# EAGLE design LSM303 breakout board-v12 (EAGLE 6.1)
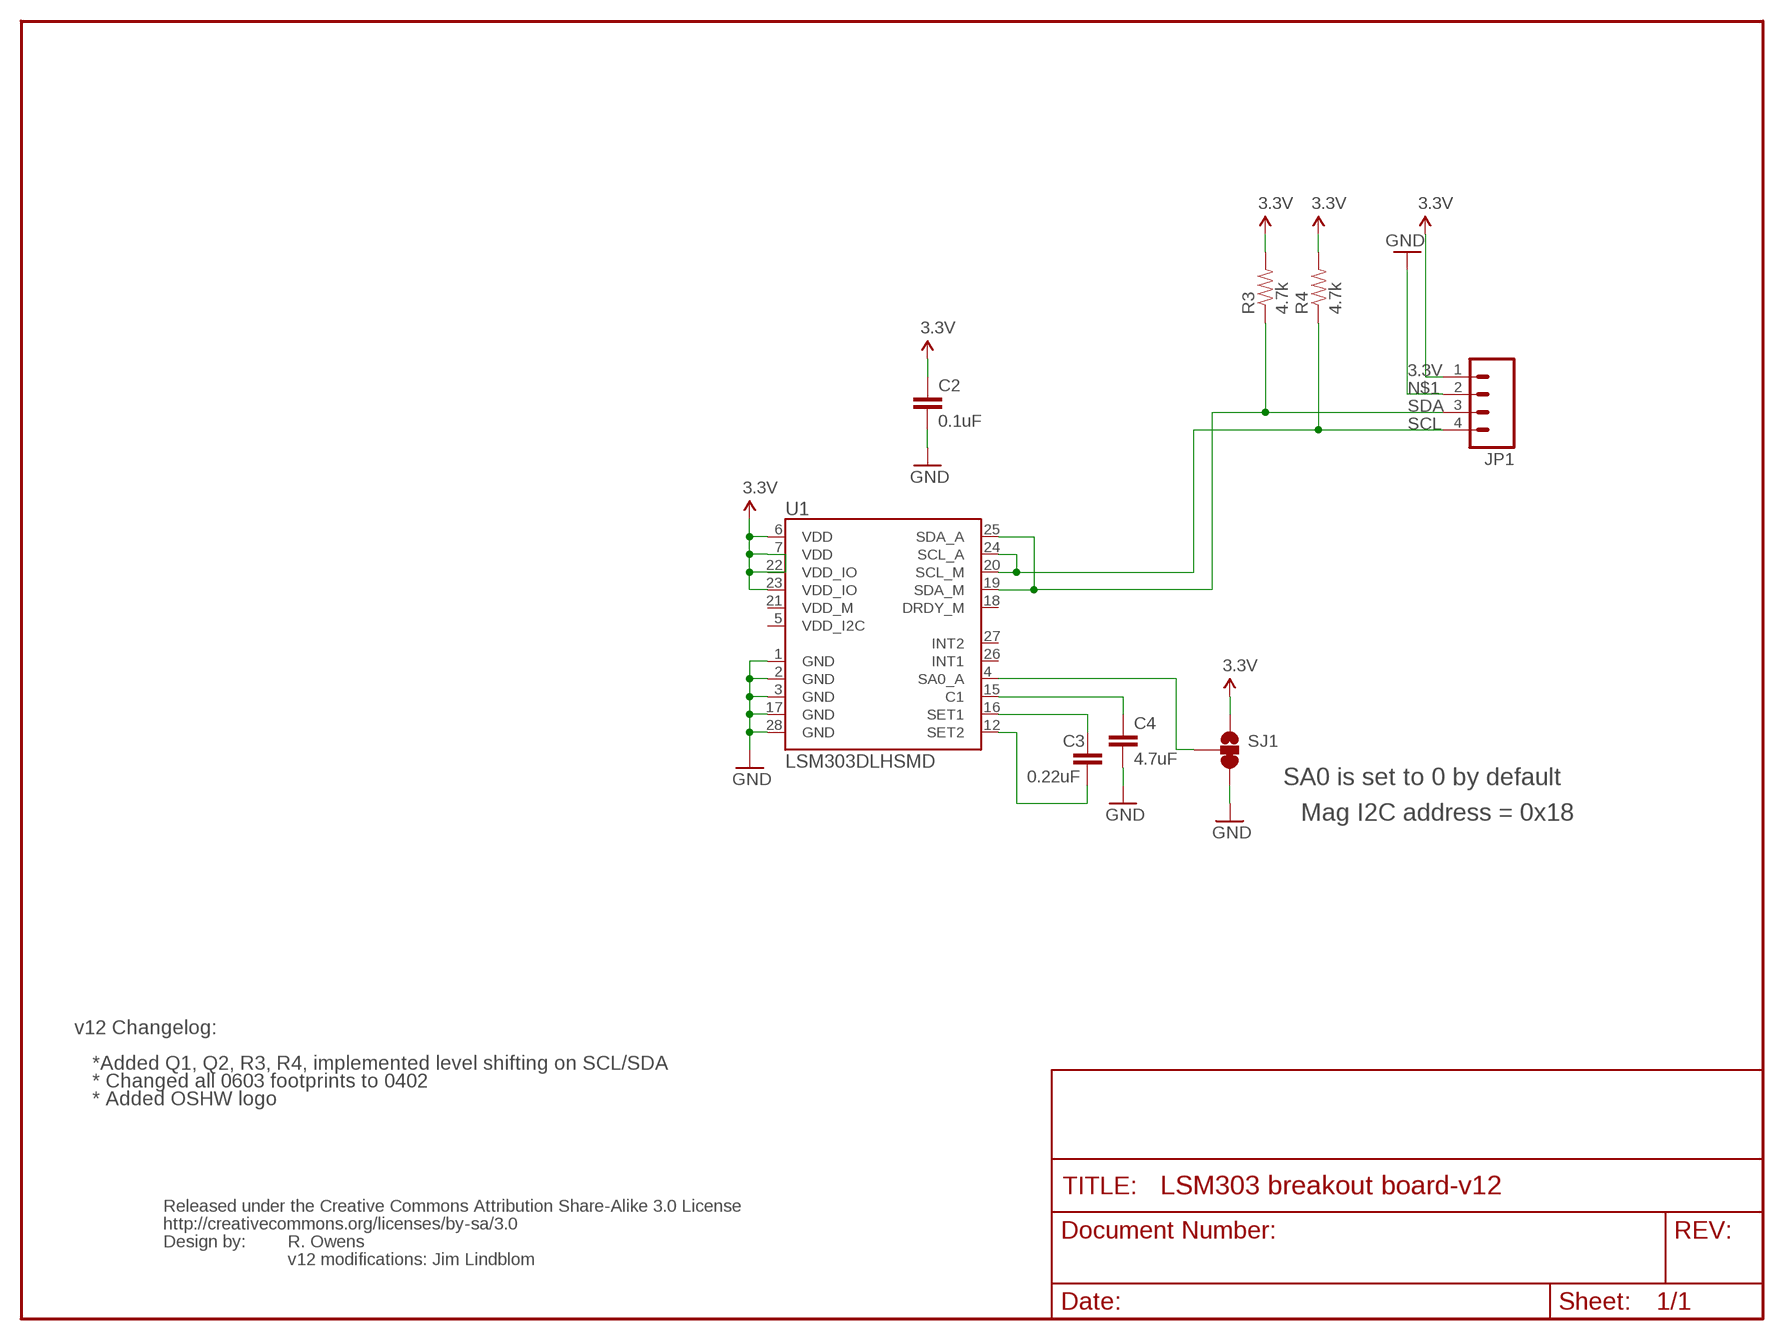
[diagram p0: schematic, sheet 1]

## Parts
C2  0.1uF  CAP0603-CAP  [0603-CAP]
C3  0.22uF  CAP0603-CAP  [0603-CAP]
C4  4.7uF  CAP1206  [1206]
JP1  M04PTH  [1X04]
R3  4.7k  RESISTOR0805-RES  [0805]
R4  4.7k  RESISTOR0805-RES  [0805]
SJ1  SOLDERJUMPER_2WAYPASTE2&3  [SJ_3_PASTE2&3]
U1  LSM303DLHSMD  [LGA28-5X5]
U$5  CREATIVE_COMMONS  [CREATIVE_COMMONS]

## Nets
3.3V: C2.1 JP1.1 R3.2 R4.2 SJ1.1 U1.6(VDD) U1.7(VDD) U1.23(VDD_IO)
N$1: C2.2 C4.2 JP1.2 SJ1.3 U1.1(GND) U1.2(GND) U1.3(GND) U1.17(GND) U1.28(GND) ; supply symbol labelled GND
N$10: C3.1 U1.16(SET1)
N$11: C3.2 U1.12(SET2)
N$12: C4.1 U1.15(C1)
SA0_A: SJ1.2 U1.4(SA0_A)
SCL: JP1.4 R4.1 U1.20(SCL_M) U1.24(SCL_A)
SDA: JP1.3 R3.1 U1.19(SDA_M) U1.25(SDA_A)
Unconnected: U1.5(VDD_I2C) U1.18(DRDY_M) U1.21(VDD_M) U1.22(VDD_IO) U1.26(INT1) U1.27(INT2)

## Notes on the sheet
- SA0 is set to 0 by default
- Mag I2C address = 0x18
- v12 Changelog:
- *Added Q1, Q2, R3, R4, implemented level shifting on SCL/SDA
- * Changed all 0603 footprints to 0402
- * Added OSHW logo
- R. Owens
- v12 modifications: Jim Lindblom

## Library data of the parts
C2-C4 = SparkFun:CAP: Capacitor Standard 0603 ceramic capacitor, and 0.1" leaded capacitor.
JP1 = SparkFun-Connectors:M04: Header 4 Standard 4-pin 0.1" header. Use with straight break away headers (SKU : PRT-00116), right angle break away headers (PRT-00553), swiss pins (PRT-00743), machine pins (PRT-00117), and female headers (PRT-00115). Molex polarized connector foot print use with SKU : PRT-08231 with associated crimp pins and housings. 1MM SMD Version SKU: PRT-10208
R3 R4 = SparkFun:RESISTOR: Resistor Basic schematic elements and footprints for 0603, 1206, and PTH resistors.
SJ1 = SparkFun:SOLDERJUMPER_2WAY: Solder Jumper 2 way solder jumper
U1 = SparkFun:LSM303DLH
U$5 = SparkFun:CREATIVE_COMMONS

## Board
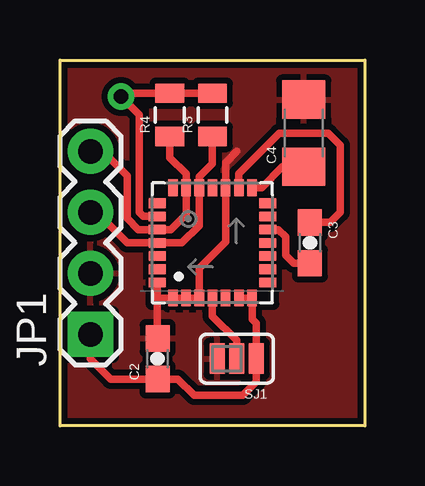
[diagram p1: board, top side]
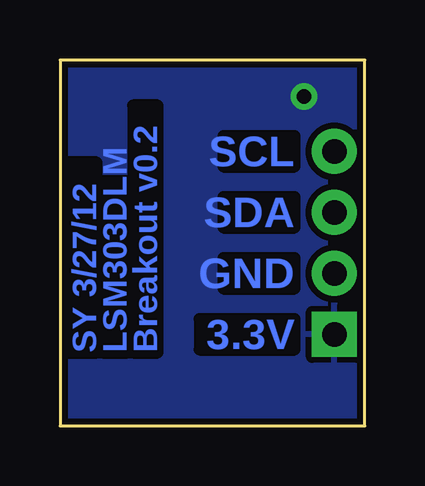
[diagram p2: board, bottom side, seen from below]

Size 12.7 x 15.24 mm. Coordinates in mm from the lower left corner, seen from the top.
Outline: 0,0 0,15.24 12.7,15.24 12.7,0 0,0
Copper layers (1*16): Top 0.035mm / dielectric 1.5mm / Bottom 0.035mm
Design rules: minimum track width 10mil, minimum drill 20mil, track to track 10mil, track to pad 5mil, pad to pad 5mil, via to via 10mil, smd to smd 5mil, copper to edge 10mil, drill to drill 10mil, minimum pad ring 12mil, minimum via ring 10mil, stop-mask expansion 4mil, vias tented up to drill 20mil, thermal gap 10mil
tRestrict: area 3.8,5.1 to 8.9,10.2

### Footprints (pad centres in the part's own frame; a part is rotated, then mirrored left to right if it is on the bottom)
0603-CAP = smd 1.1 x 1: 1 -0.85,0; 2 0.85,0
1206 = smd 1.6 x 1.8: 1 -1.4,0; 2 1.4,0
1X04 = drill 1.016 pad 1.88 square: 1 0,0 | drill 1.016 pad 1.88: 2 2.54,0; 3 5.08,0; 4 7.62,0
0805 = smd 0.8 x 1.2: 1 -0.9,0; 2 0.9,0
SJ_3_PASTE2&3 = smd 0.635 x 1.27: 1 -0.813,0; 2 0,0; 3 0.813,0
LGA28-5X5 = smd 0.7 x 0.4: 1 -2.3,1.65; 2 -2.3,1.1; 3 -2.3,0.55; 4 -2.3,0; 5 -2.3,-0.55; 6 -2.3,-1.1; 7 -2.3,-1.65; 15 2.3,-1.65; 16 2.3,-1.1; 17 2.3,-0.55; 18 2.3,0; 19 2.3,0.55; 20 2.3,1.1; 21 2.3,1.65 | smd 0.4 x 0.7: 8 -1.65,-2.3; 9 -1.1,-2.3; 10 -0.55,-2.3; 11 0,-2.3; 12 0.55,-2.3; 13 1.1,-2.3; 14 1.65,-2.3; 22 1.65,2.3; 23 1.1,2.3; 24 0.55,2.3; 25 0,2.3; 26 -0.55,2.3; 27 -1.1,2.3; 28 -1.65,2.3

### Placement (x,y rotation side)
C2  4.06,2.79 90 top
C3  10.41,7.62 270 top
C4  10.16,12.19 90 top
JP1  1.27,3.81 90 top
R3  6.35,12.95 90 top
R4  4.57,12.95 90 top
SJ1  7.37,2.79 180 top
U1  6.35,7.62 90 top
U$5  -10.41,-9.4 0 top  (outside the outline)

### Tracks (layer width: path | path; a pad name or v marks a point on that pad's centre or on a via)
3.3V  (via drill 0.6)
  Top 0.305: U1.6 U1.7 8,4.45 8.18,4.27 SJ1.1 8.18,1.83 7.62,1.27 5.59,1.27 4.91,1.94 C2.1 2.12,1.94 1.27,2.79 JP1.1 | R3.2 R4.2 2.68,13.85 v2.54,13.72 3.3,12.95 3.3,8.89 3.47,8.72 U1.23
  pour Bottom (isolate 0.254): 0,0 0,15.24 12.7,15.24 12.7,0
N$1
  Top 0.305: U1.28 4.05,5.33 | 4.05,5.33 4.05,3.46 C2.2 | 4.05,5.33 4.06,5.32 U1.1 U1.2 U1.3 5.8,6.56 6.9,7.66 U1.17 6.9,10.96 7.37,11.43
  pour Top (isolate 0.254): 0,0 0,15.24 12.7,15.24 12.7,0
N$10
  Top 0.305: U1.16 7.45,10.5 9.14,12.19 11.18,12.19 11.68,11.68 11.68,8.89 11.26,8.47 C3.1
N$11
  Top 0.305: C3.2 9.74,6.77 9.4,7.11 9.4,7.87 9.1,8.17 U1.12
N$12
  Top 0.305: U1.15 8.4,9.92 9.27,10.79 C4.1
SA0_A
  Top 0.305: U1.4 6.35,4.57 7.37,3.56 SJ1.2
SCL
  Top 0.305: JP1.4 1.78,11.43 2.79,10.41 2.79,8.64 3.26,8.17 U1.24 4.61,8.17 5.25,8.81 U1.20 5.25,10.5 4.57,11.18 R4.1
SDA
  Top 0.305: JP1.3 1.52,8.89 2.79,7.62 U1.25 5.08,7.62 5.8,8.34 U1.19 5.8,10.37 6.35,10.92 R3.1

### Text on the board
Bottom: SCL | SDA | GND | 3.3V | Breakout v0.2 | LSM303DLM | SY 3/27/12